# Altium schematic sheet Sheet1.SchDoc
size A0
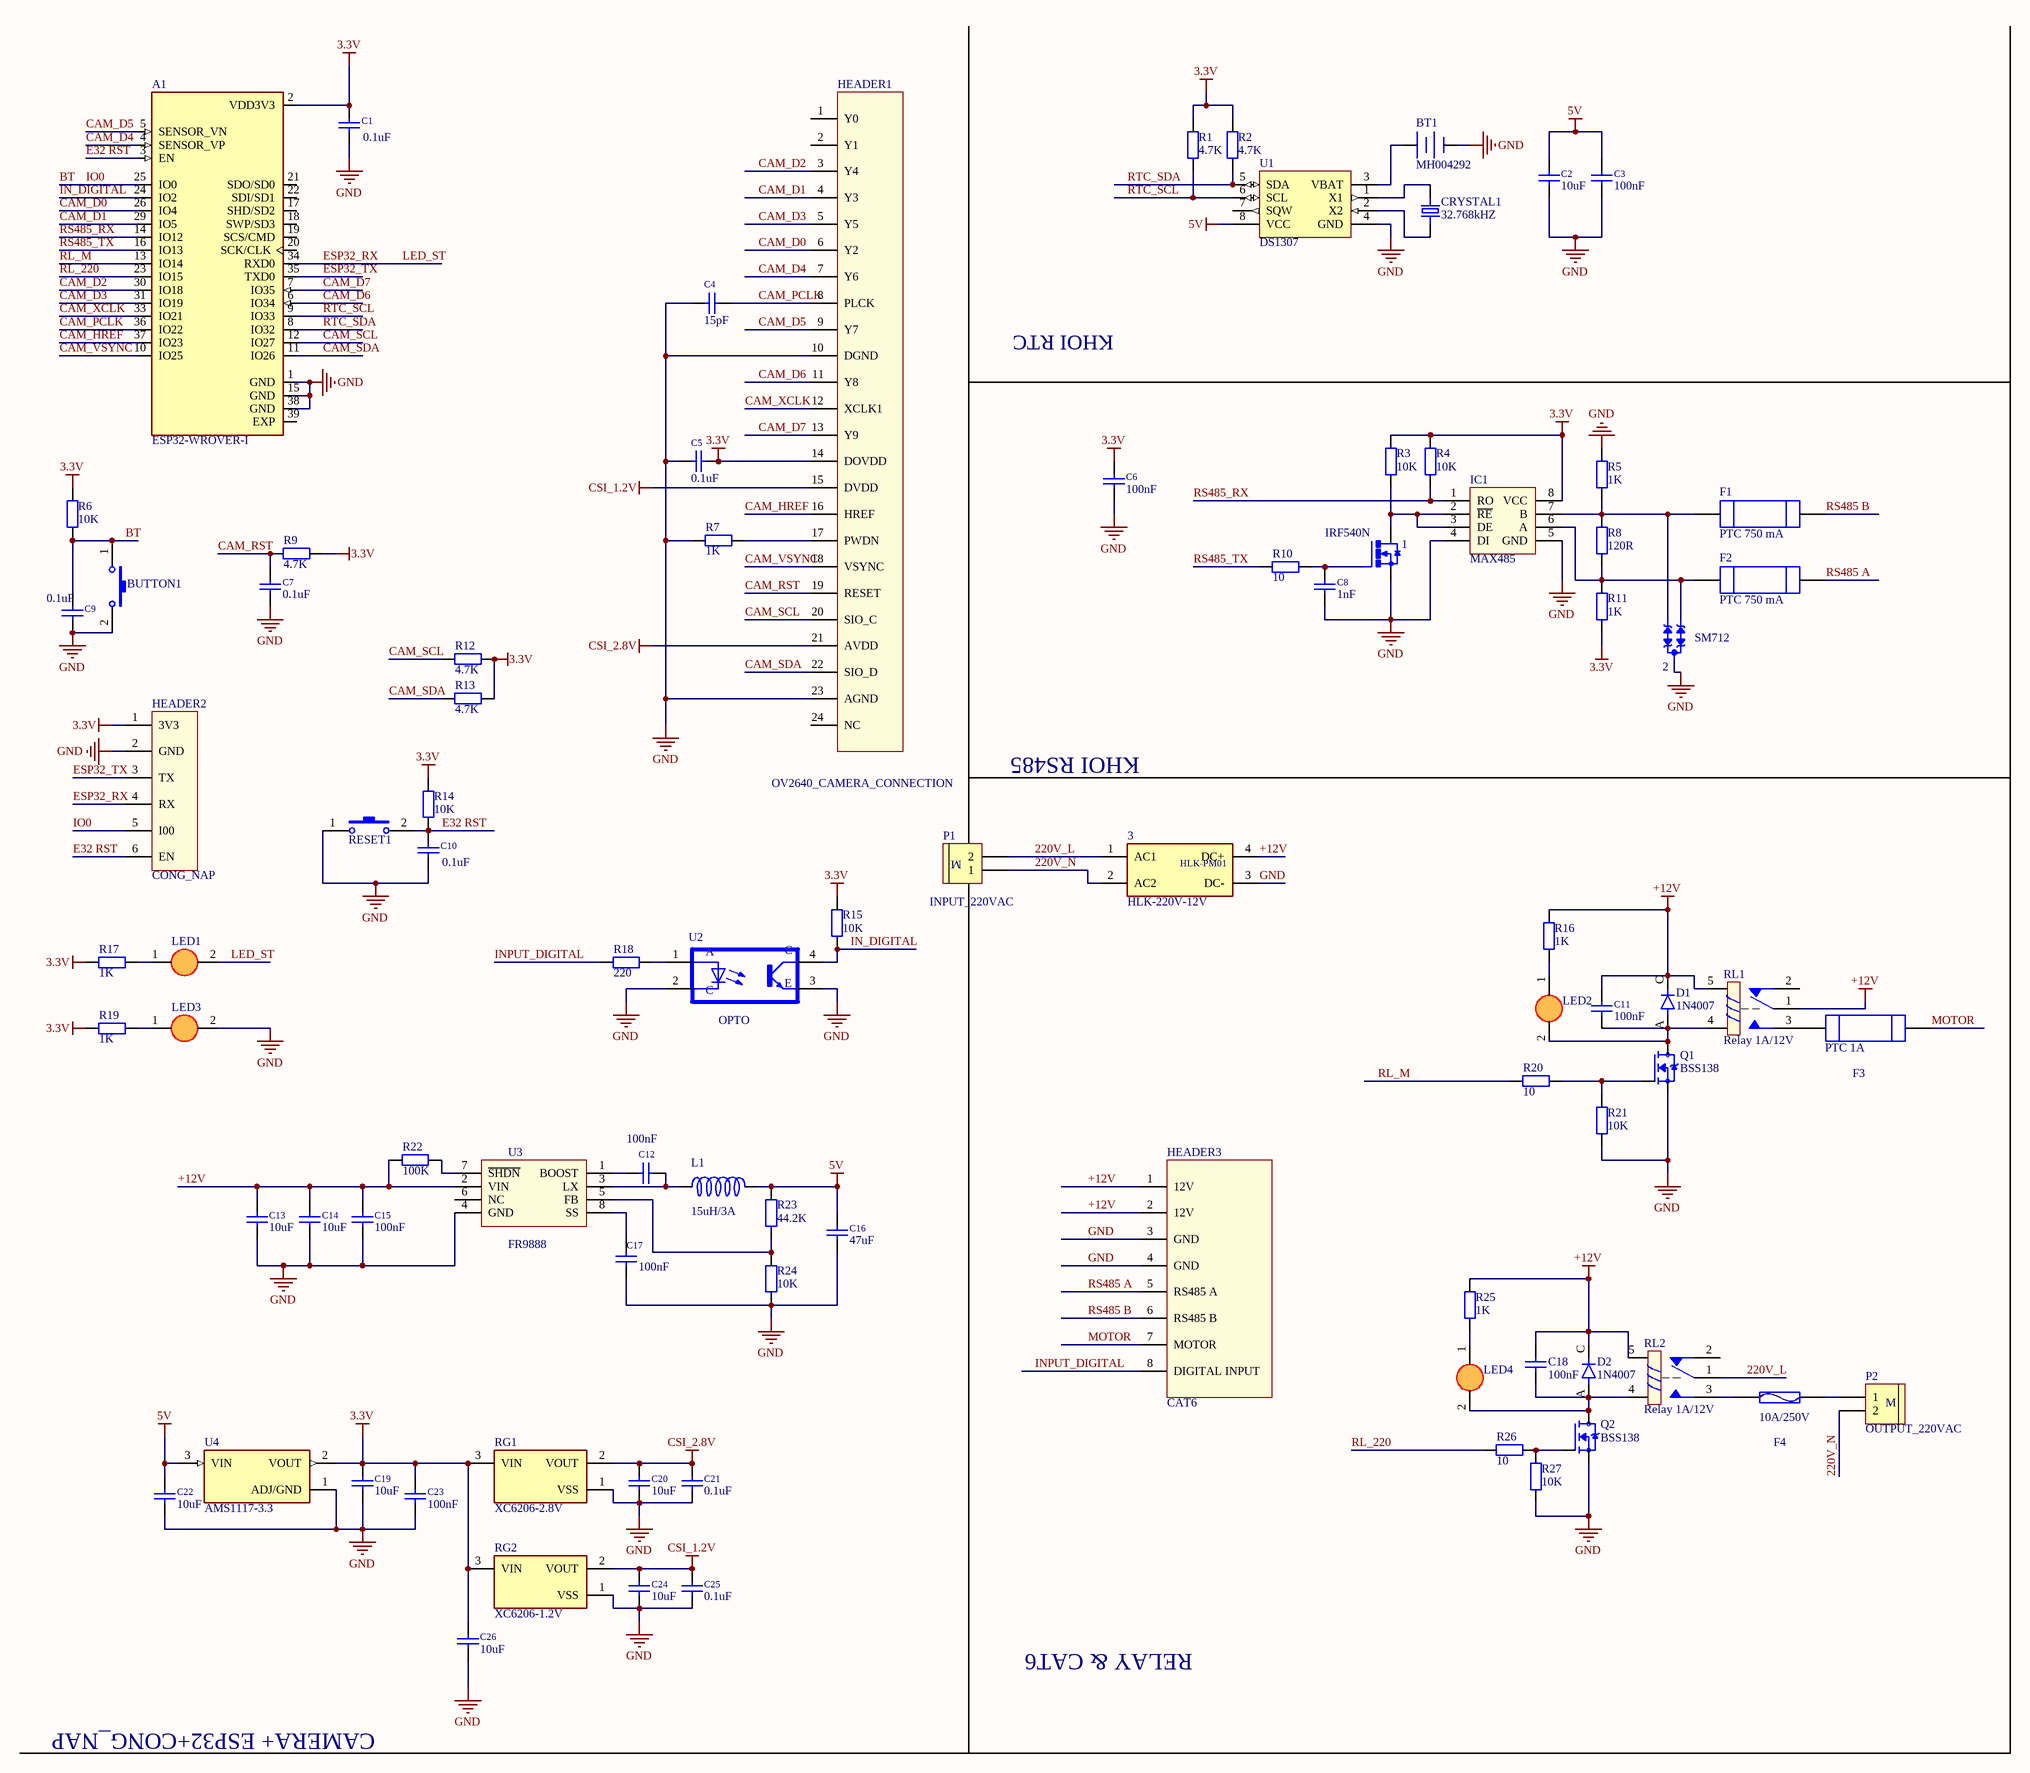
[diagram p0: Sheet1.SchDoc]

## Parts
1  IRF540N  [D2PACK]
2  SM712  [SOT23-3]
3  HLK-220V-12V  [HLK 220-12]
A1  ESP32-WROVER-I  [XCVR_ESP32-WROVER-I]
BT1  MH004292  [DE PINCR1220]
BUTTON1  SW-2P-S  [BUTTON_4_PIN]  (value not drawn)
C1  0.1uF  [Tu 0603]
C2  10uF  [C1210]
C3  100nF  [Tu 0603]
C4  15pF  [Tu 0603]
C5  0.1uF  [Tu 0603]
C6  100nF  [Tu 0603]
C7  0.1uF  [Tu 0603]
C8  1nF  [Tu 0603]
C9  0.1uF  [Tu 0603]
C10  0.1uF  [Tu 0603]
C11  100nF  [Tu 0603]
C12  100nF  [Tu 0603]
C13  10uF  [C1210]
C14  10uF  [C1210]
C15  100nF  [Tu 0603]
C16  47uF  [C1210]
C17  100nF  [Tu 0603]
C18  100nF  [Tu 0603]
C19  10uF  [C1210]
C20  10uF  [C1210]
C21  0.1uF  [Tu 0603]
C22  10uF  [C1210]
C23  100nF  [Tu 0603]
C24  10uF  [C1210]
C25  0.1uF  [Tu 0603]
C26  10uF  [C1210]
CRYSTAL1  32.768kHZ  [XTAL_ABS07-32.768KHZ-T]
D1  1N4007  [DIOAD1060W80L520D270]
D2  1N4007  [DIOAD1060W80L520D270]
F1  PTC 750 mA  [1812]
F2  PTC 750 mA  [1812]
F3  PTC 1A  [1812]
F4  10A/250V  [FUSE_10A]
HEADER1  OV2640_CAMERA_CONNECTION  [OV2640_0.5mm]
HEADER2  CONG_NAP  [CONG_NAP]
HEADER3  CAT6  [CAT6_3.5mm]
IC1  MAX485  [SO-8]
L1  15uH/3A  [CUON CAM 200mil]
LED1  (no value)  [LED_SMD_0603 - duplicate1]
LED2  (no value)  [LED_SMD_0603 - duplicate1]
LED3  (no value)  [LED_SMD_0603 - duplicate1]
LED4  (no value)  [LED_SMD_0603 - duplicate1]
P1  INPUT_220VAC  [Medium - Header 2]
P2  OUTPUT_220VAC  [Medium - Header 2]
Q1  BSS138  [SOT95P240X111-3N]
Q2  BSS138  [SOT95P240X111-3N]
R1  value 4.7K  [TRO SMD 0603]  (hidden comment: RES_08)
R2  value 4.7K  [TRO SMD 0603]  (hidden comment: RES_08)
R3  value 10K  [TRO SMD 0603]  (hidden comment: RES_08)
R4  value 10K  [TRO SMD 0603]  (hidden comment: RES_08)
R5  value 1K  [TRO SMD 0603]  (hidden comment: RES_08)
R6  value 10K  [DIEN TRO 0805]  (hidden comment: RES_08)
R7  value 1K  [TRO SMD 0603]  (hidden comment: RES_08)
R8  value 120R  [TRO SMD 0603]  (hidden comment: RES_08)
R9  value 4.7K  [TRO SMD 0603]  (hidden comment: RES_08)
R10  value 10  [TRO SMD 0603]  (hidden comment: RES_08)
R11  value 1K  [TRO SMD 0603]  (hidden comment: RES_08)
R12  value 4.7K  [TRO SMD 0603]  (hidden comment: RES_08)
R13  value 4.7K  [TRO SMD 0603]  (hidden comment: RES_08)
R14  value 10K  [TRO SMD 0603]  (hidden comment: RES_08)
R15  value 10K  [TRO SMD 0603]  (hidden comment: RES_08)
R16  value 1K  [TRO SMD 0603]  (hidden comment: RES_08)
R17  value 1K  [TRO SMD 0603]  (hidden comment: RES_08)
R18  value 220  [TRO SMD 0603]  (hidden comment: RES_08)
R19  value 1K  [TRO SMD 0603]  (hidden comment: RES_08)
R20  value 10  [TRO SMD 0603]  (hidden comment: RES_08)
R21  value 10K  [TRO SMD 0603]  (hidden comment: RES_08)
R22  value 100K  [TRO SMD 0603]  (hidden comment: RES_08)
R23  value 44.2K  [DIEN TRO 0805]  (hidden comment: RES_08)
R24  value 10K  [TRO SMD 0603]  (hidden comment: RES_08)
R25  value 1K  [TRO SMD 0603]  (hidden comment: RES_08)
R26  value 10  [TRO SMD 0603]  (hidden comment: RES_08)
R27  value 10K  [TRO SMD 0603]  (hidden comment: RES_08)
RESET1  SW-2P-S  [BUTTON_4_PIN]  (value not drawn)
RG1  Part Number: XC6206-2.8V  [Torex_https--www.torexsemi.com-file-SOT-23-SOT-23-pkg.pdf_0]  (hidden comment: Reg_Torex_XC6206P332MR_eec)
RG2  Part Number: XC6206-1.2V  [Torex_https--www.torexsemi.com-file-SOT-23-SOT-23-pkg.pdf_0]  (hidden comment: Reg_Torex_XC6206P332MR_eec)
RL1  Relay 1A/12V  [RL_SPDT_10A]
RL2  Relay 1A/12V  [RL_SPDT_10A]
U1  DS1307  [SOIC8]
U2  OPTO  [SOIC254P1016X390-4N]
U3  FR9888  [FR9888_SMD]
U4  AMS1117-3.3  [SOT229P700X180-4N]

## Nets
3.3V: A1.2(VDD3V3) C1.1 C5.2 C6.1 C19.1 C23.1 C26.1 HEADER1.14(DOVDD) HEADER2.1(3V3) IC1.8(VCC) R1.1 R2.1 R3.1 R4.1 R6.1 R9.1 R11.2 R12.1 R13.1 R14.2 R15.1 R17.2 R19.2 RG1.3(VIN) RG2.3(VIN) U4.2(VOUT)
5V: C2.1 C3.1 C16.1 C22.1 L1.2 R23.1 U1.8(VCC) U4.3(VIN)
+12V: 3.4(DC+) C11.1 C13.1 C14.1 C15.2 C18.2 D1.C D2.C HEADER3.1(12V) HEADER3.2(12V) R16.2 R22.2 R25.2 RL1.1 RL1.5 RL2.5 U3.2(VIN)
CSI_1.2V: C24.1 C25.1 HEADER1.15(DVDD) RG2.2(VOUT)
CSI_2.8V: C20.1 C21.1 HEADER1.21(AVDD) RG1.2(VOUT)
GND: 1.3(S) 2.3(P$3) 3.3(DC-) A1.1(GND) A1.15(GND) A1.38(GND) BT1.2(-) BUTTON1.2 C1.2 C2.2 C3.2 C4.1 C5.1 C6.2 C7.2 C8.2 C9.2 C10.2 C13.2 C14.2 C15.1 C16.2 C17.2 C19.2 C20.2 C21.2 C22.2 C23.2 C24.2 C25.2 C26.2 HEADER1.10(DGND) HEADER1.23(AGND) HEADER2.2(GND) HEADER3.3(GND) HEADER3.4(GND) IC1.4(DI) IC1.5(GND) LED3.2(K) Q1.2(S) Q2.2(S) R5.1 R7.2 R21.2 R24.2 R27.2 RESET1.1 RG1.1(VSS) RG2.1(VSS) U1.4(GND) U2.2(C) U2.3(E) U3.4(GND) U4.1(ADJ/GND)
220V_L: 3.1(AC1) P1.2 RL2.1
220V_N: 3.2(AC2) P1.1 P2.2
BT: A1.25(IO0) BUTTON1.1 C9.1 HEADER2.5(I00) R6.2  [also labelled IO0]
CAM_D0: A1.26(IO4) HEADER1.6(Y2)
CAM_D1: A1.29(IO5) HEADER1.4(Y3)
CAM_D2: A1.30(IO18) HEADER1.3(Y4)
CAM_D3: A1.31(IO19) HEADER1.5(Y5)
CAM_D4: A1.4(SENSOR_VP) HEADER1.7(Y6)
CAM_D5: A1.5(SENSOR_VN) HEADER1.9(Y7)
CAM_D6: A1.6(IO34) HEADER1.11(Y8)
CAM_D7: A1.7(IO35) HEADER1.13(Y9)
CAM_HREF: A1.37(IO23) HEADER1.16(HREF)
CAM_PCLK: A1.36(IO22) C4.2 HEADER1.8(PLCK)
CAM_RST: C7.1 HEADER1.19(RESET) R9.2
CAM_SCL: A1.12(IO27) HEADER1.20(SIO_C) R12.2
CAM_SDA: A1.11(IO26) HEADER1.22(SIO_D) R13.2
CAM_VSYNC: A1.10(IO25) HEADER1.18(VSYNC)
CAM_XCLK: A1.33(IO21) HEADER1.12(XCLK1)
E32 RST: A1.3(EN) C10.1 HEADER2.6(EN) R14.1 RESET1.2
ESP32_RX: A1.34(RXD0) HEADER2.4(RX) LED1.2(K)  [also labelled LED_ST]
ESP32_TX: A1.35(TXD0) HEADER2.3(TX)
IN_DIGITAL: A1.24(IO2) R15.2 U2.4(CO)
INPUT_DIGITAL: HEADER3.8(DIGITAL_INPUT) R18.2
MOTOR: F3.2 HEADER3.7(MOTOR)
RL_220: A1.23(IO15) R26.1
RL_M: A1.13(IO14) R20.1
RS485 A: F2.2 HEADER3.5(RS485_A)
RS485 B: F1.2 HEADER3.6(RS485_B)
RS485_RX: A1.14(IO12) IC1.1(RO) R4.2
RS485_TX: A1.16(IO13) R10.1
RTC_SCL: A1.9(IO33) R1.2 U1.6(SCL)
RTC_SDA: A1.8(IO32) R2.2 U1.5(SDA)
Net1_1: 1.1(G) C8.1 R10.2
Net1_2: 1.2(D) IC1.2(~{RE}) IC1.3(DE) R3.2
Net2_1: 2.1(P$1) F2.1 IC1.6(A) R8.2 R11.1
Net2_2: 2.2(P$2) F1.1 IC1.7(B) R5.2 R8.1
NetBT1_1: BT1.1(+) U1.3(VBAT)
NetC11_2: C11.2 D1.A LED2.2(K) Q1.3(D) RL1.4
NetC12_1: C12.1 U3.1(BOOST)
NetC12_2: C12.2 L1.1 U3.3(LX)
NetC17_1: C17.1 U3.8(SS)
NetC18_1: C18.1 D2.A LED4.2(K) Q2.3(D) RL2.4
NetCRYSTAL1_1: CRYSTAL1.1 U1.2(X2)
NetCRYSTAL1_2: CRYSTAL1.2 U1.1(X1)
NetF3_1: F3.1 RL1.3
NetF4_1: F4.1 RL2.3
NetF4_2: F4.2 P2.1
NetHEADER1_17: HEADER1.17(PWDN) R7.1
NetLED1_1: LED1.1(A) R17.1
NetLED2_1: LED2.1(A) R16.1
NetLED3_1: LED3.1(A) R19.1
NetLED4_1: LED4.1(A) R25.1
NetQ1_1: Q1.1(G) R20.2 R21.1
NetQ2_1: Q2.1(G) R26.2 R27.1
NetR18_1: R18.1 U2.1(A)
NetR22_1: R22.1 U3.7(~{SHDN})
NetR23_2: R23.2 R24.1 U3.5(FB)

Not connected (* = marked no-connect by the designer): A1 17(SHD/SD2) 18(SWP/SD3) 19(SCS/CMD) 20(SCK/CLK) 21(SDO/SD0) 22(SDI/SD1) 39(EXP); HEADER1 1(Y0) 2(Y1) 24(NC); RL1 2; RL2 2; U1 7(SQW); U3 6(NC)

## Notes on the sheet
- 1.50
- KHOI RTC
- KHOI RS485
- RELAY & CAT6
- CAMERA+ ESP32+CONG_NAP
- Title
- Size:
- Date:
- File:
- A0
- Number:
- Time:
- Revision:
- Sheet
- of
- (in symbol Header 2 - M) M

## Library data of the parts
1 = IRF540N: N-Channel 100V 33A _Tc_ 130W _Tc_ Surface Mount D2PAK; MF: Infineon Technologies; Price: None; SnapEDA_Link: https://www.snapeda.com/parts/IRF540N/Infineon%20Technologies/view-part/2527495/?ref=snap; MP: IRF540N; Value: *; Availability: Unavailable; Package: TO-263-3 Infineon Technologies
2 = CDSOT23-SM712: 26V, 14V Clamp 17A _8/20Âµs_ Ipp Tvs Diode Surface Mount SOT-23-3; MF: Bourns; Value: *; SnapEDA_Link: https://www.snapeda.com/parts/CDSOT23-SM712/Bourns%20-%20J.W.%20Miller/view-part/33771/?ref=snap; MP: CDSOT23-SM712; Availability: Unavailable; Price: None; Package: SOT-23 Bourns
3 = HLK-PM01: MF: Hi-link; Availability: Unavailable; SnapEDA_Link: https://www.snapeda.com/parts/hlk-pm01/Hi-link/view-part/2875605/?ref=snap; Price: None; Package: Package Analog Devices; MP: hlk-pm01; Value: *
A1 = ESP32-WROVER-I: Bluetooth, WiFi 802.11b/g/n, Bluetooth v4.2 + EDR, Class 1, 2 and 3 Transceiver Module 2.4GHz ~ 2.5GHz Antenna Not Included, I-PEX Surface Mount; MF: Espressif Systems; Package: Module Espressif Systems; Availability: Unavailable; MP: ESP32-WROVER-I; Value: *; SnapEDA_Link: https://www.snapeda.com/parts/ESP32-WROVER-I/Espressif%20Systems/view-part/2298808/?ref=snap; Price: None
BT1 = De Pin 3.3V: Dán; LatestRevisionDate: Đế Pin CR2032 SMD003
BUTTON1 RESET1 = SW-2PIN-SMALL: Switch Small 2 Pin; Published: 24-Mar-1999; LatestRevisionDate: 17-Jul-2002; LatestRevisionNote: Re-released for DXP Platform.; PackageReference: SPST-2; Publisher: Altium Limited
C1-C17 C19-C26 = Capacitor: AEMS Code: 2100341; Vendor: Digikey; Volt: 16V; Published: 13-April-2009; Publisher: Hoang Nguyen; ComponentLink1Description: Digikey Part Link; ComponentLink2Description: Open Datasheet; ComponentLink2URL: H:\LIBRARY\LIBRARY.Datasheet\
  C1 C5 C7 C9 C10 C21 C25: Value: 0.1uF
  C2 C13 C14 C19 C20 C22 C24 C26: Value: 10uF
  C3 C6 C11 C12 C15 C17 C23: Value: 100nF
  C4: Value: 15pF
  C8: Value: 1nF
  C16: Value: 47uF
C18 = Cap SMD 1206
CRYSTAL1 = ABS07-32.768KHZ-T: 32.768kHz Â±20ppm Crystal 12.5pF 70 kOhms 2-SMD, No Lead; MF: Abracon LLC; Price: None; Value: *; Package: SMD-2 Abracon; Availability: Unavailable; SnapEDA_Link: https://www.snapeda.com/parts/ABS07-32.768KHZ/Abracon%20LLC/view-part/448682/?ref=snap; MP: ABS07-32.768KHZ
D1 D2 = 1N4007: Diode Standard 1000V 1A Through Hole DO-204AL _DO-41_; MF: ON Semiconductor; Package: DO-41 Good-Ark; Value: *; Price: None; MP: 1N4007; Availability: Unavailable; SnapEDA_Link: https://www.snapeda.com/parts/1N4007/ON%20Semiconductor/view-part/2816213/?ref=snap
F1-F3 = 1812L075PR: Polymeric PTC Resettable Fuse 13.2V 750mA Ih Surface Mount 1812 _4532 Metric_, Concave; MF: Littelfuse Inc.; SnapEDA_Link: https://www.snapeda.com/parts/1812L075PR/Littelfuse%20Inc./view-part/46903/?ref=snap; MP: 1812L075PR; Availability: Unavailable; Price: None; Value: *; Package: 1812 Littelfuse
F4 = Fuse 1: Fuse; Published: 8-Jun-2000; LatestRevisionDate: 17-Jul-2002; LatestRevisionNote: Re-released for DXP Platform.; PackageReference: PIN-W2/E2.8; Publisher: Altium Limited
HEADER1 = OV2640_CAMERA
HEADER2 = HEADER_6
IC1 = MAX485: RS232 - RS485 (Same sn75176)
L1 = Conductor
LED1-LED4 = LED 5mm
P1 P2 = Header 2 - M: Header, 2-Pin, Medium; LatestRevisionDate: 17-Jul-2002; LatestRevisionNote: Re-released for DXP Platform.; Publisher: Altium Limited
Q1 Q2 = BSS138: N-Channel 50V 220mA (Ta) 360mW (Ta) Surface Mount SOT-23-3; MF: MICROSS/On Semiconductor; DigiKey-Purchase-URL: https://snapeda.com/shop?store=DigiKey&id=2773844; Package: TO-236-3 Micross; Arrow_Electronics-Purchase-URL: https://snapeda.com/shop?store=Arrow+Electronics&id=2773844; Value: *; MP: BSS138; Price: None; SnapEDA_Link: https://www.snapeda.com/parts/BSS138/MICROSS/On%20Semiconductor/view-part/2773844/?ref=snap; Mouser-Purchase-URL: https://snapeda.com/shop?store=Mouser&id=2773844; Availability: Good
RG1 RG2 = Reg_Torex_XC6206P332MR_eec: Manufacturer: Torex; Voltage: 3.3V; Category 9E07530Daf1645C0: Semiconductors and Actives; Category Bb4C76468Af8608B: Linear Regulators; Accuracy: ±2%; Category 56439B4967F48D84: Power Management; Num Pins: 3; Dropout Voltage: 250mV; Maximum Output Current: 200mA; helpURL: https://upverter.com/upn/revision/d425e2ef490922a5/; ComponentLink2Description: Datasheet; Temperature: -40°C to +85°C; Package: https://www.torexsemi.com/file/SOT-23/SOT-23-pkg.pdf; Supplier 2: Mouser; Supplier 1: Digi-Key; ComponentLink1URL: https://upverter.com/upn/revision/d425e2ef490922a5/; Supplier Part Number 2: 865-XC6206P332MR-G; ComponentLink1Description: Upverter; ComponentLink2URL: https://www.torexsemi.com/file/xc6206/XC6206.pdf; RoHS: TRUE; Mouser Part Number: 865-XC6206P332MR-G; Ipc Land Pattern Name: SOT95P280X110-3; Temperature Range High: +85°C; Temperature Range Low: -40°C; Lead Free: yes; Mfg Package Ident: https://www.torexsemi.com/file/SOT-23/SOT-23-pkg.pdf; Octopart Part Number: e32b2b70e2ce3cec
RL1 RL2 = Relay 1: Relay SPDT,10A - 12VDC 5 Pin; Value: Relay SPDT, 10A, 12V
U1 = DS1307: Realtime Clock IC; Manufacturer: Maxim; ComponentLink1Description: Digikey Part Link; ComponentLink2Description: Open Datasheet; ComponentLink2URL: H:\LIBRARY\LIBRARY.Datasheet\DS1307.pdf
U2 = SFH615A-3X009T: Optoisolator Transistor Output 5300Vrms 1 Channel 4-SMD; MF: Vishay Semiconductor; Value: *; Package: SMD-4 Vishay Semiconductor; MP: SFH615A-3X009T; Price: None; Availability: Unavailable; SnapEDA_Link: https://www.snapeda.com/parts/SFH615A-3X009T/Vishay%20Semiconductor%20Opto%20Division/view-part/697564/?ref=snap
U4 = AMS1117-3.3: Sot223/Pkg 1-Amp 3.3-Volt Low Drop Out Voltage Regulatator; MF: Advanced Monolithic Systems; Price: None; Package: None; Value: *; MP: AMS1117-3.3; Availability: Unavailable; SnapEDA_Link: https://www.snapeda.com/parts/AMS1117-3.3/Advanced%20Monolithic%20Systems/view-part/53450/?ref=snap
R1-R27 = RES_08: Published: 8-Jun-2000; LatestRevisionDate: 17-Jul-2002; LatestRevisionNote: Re-released for DXP Platform.; PackageReference: AXIAL-0.4; Publisher: Altium Limited